# EAGLE design 04B-345 (EAGLE 9.6.2)
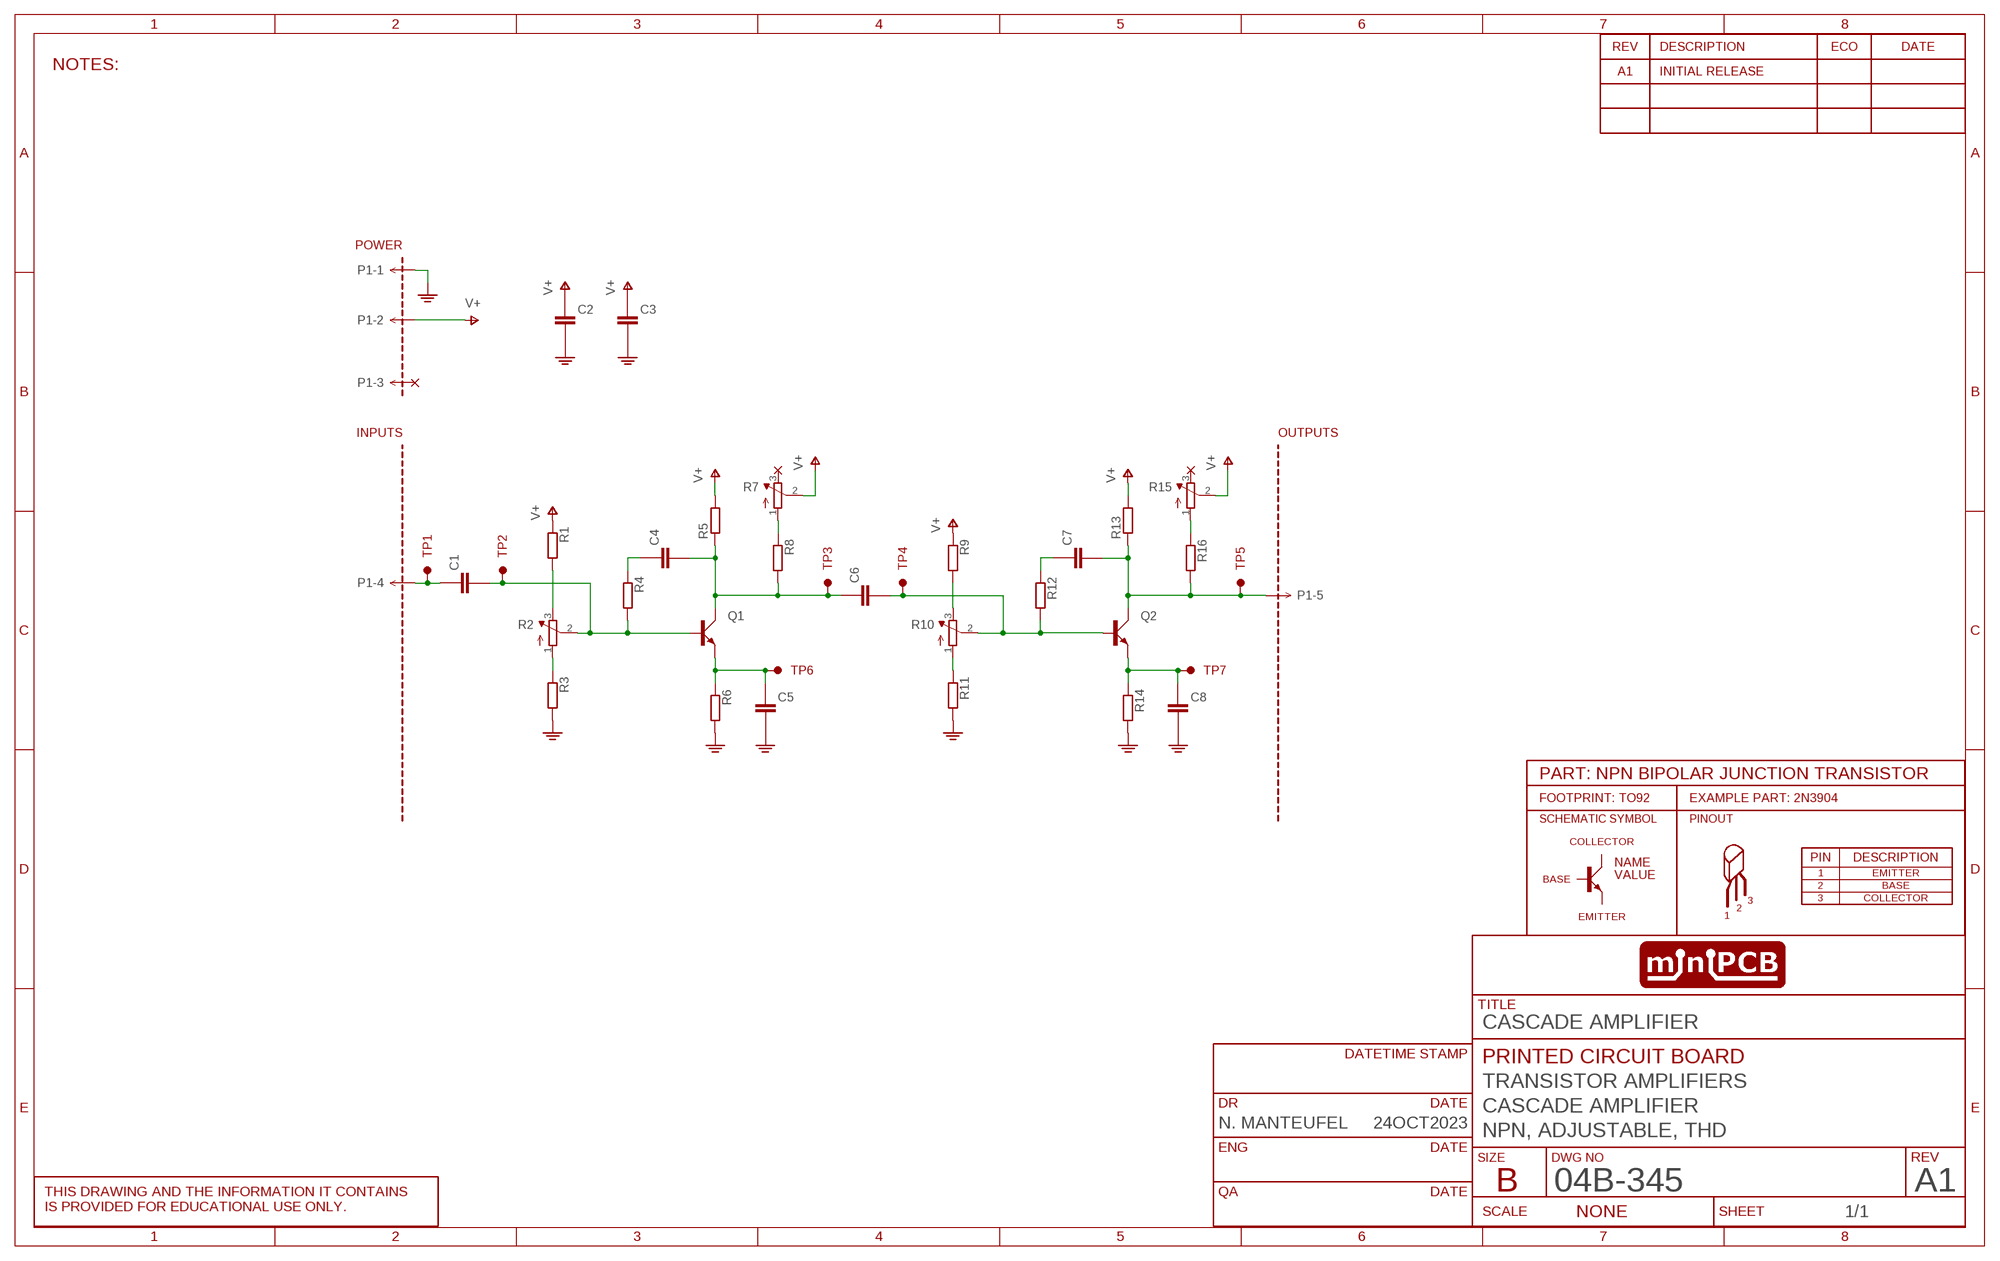
[diagram p0: schematic, sheet 1]
SHEET1 (SCHEMATIC): CIRCUIT_CATEGORY: TRANSISTOR AMPLIFIERS; CIRCUIT_NAME: CASCADE AMPLIFIER; CIRCUIT_VARIANT: NPN, ADJUSTABLE, THD; DR: N. MANTEUFEL; DR_DATE: 24OCT2023; PCB_PCBA: PRINTED CIRCUIT BOARD; REVA: A1; REVISION: A1; TITLE: CASCADE AMPLIFIER

## Parts
C1  CAPACITORTHD  [C050-024X044]
C2  CAPACITORTHD  [C050-024X044]
C3  CAPACITOR_10  [C5MM]
C4  CAPACITORTHD  [C050-024X044]
C5  CAPACITOR_10  [C5MM]
C6  CAPACITORTHD  [C050-024X044]
C7  CAPACITORTHD  [C050-024X044]
C8  CAPACITOR_10  [C5MM]
P1  MINIPCB_5P5P  [PINS_1X5]
PCB1  MINIPCB_0P50X75  [MINIPCB_0P_50X75]
Q1  BJT_NPNEBC  [TO92-EBC-OVAL]
Q2  BJT_NPNEBC  [TO92-EBC-OVAL]
R1  RESISTORTHD  [0204/10]
R2  TRIMPOT0.100THD  [TRIM_0100]
R3  RESISTORTHD  [0204/10]
R4  RESISTORTHD  [0204/10]
R5  RESISTORTHD  [0204/10]
R6  RESISTORTHD  [0204/10]
R7  TRIMPOT0.100THD  [TRIM_0100]
R8  RESISTORTHD  [0204/10]
R9  RESISTORTHD  [0204/10]
R10  TRIMPOT0.100THD  [TRIM_0100]
R11  RESISTORTHD  [0204/10]
R12  RESISTORTHD  [0204/10]
R13  RESISTORTHD  [0204/10]
R14  RESISTORTHD  [0204/10]
R15  TRIMPOT0.100THD  [TRIM_0100]
R16  RESISTORTHD  [0204/10]
TP1  TESTPOINTKE5000-SMTEXT  [PINS_1_TESTPOINT_KE5000_NOTEXT]
TP2  TESTPOINTKE5000-SMTEXT  [PINS_1_TESTPOINT_KE5000_NOTEXT]
TP3  TESTPOINTKE5000-SMTEXT  [PINS_1_TESTPOINT_KE5000_NOTEXT]
TP4  TESTPOINTKE5000-SMTEXT  [PINS_1_TESTPOINT_KE5000_NOTEXT]
TP5  TESTPOINTKE5000-SMTEXT  [PINS_1_TESTPOINT_KE5000_NOTEXT]
TP6  TESTPOINTKE5000-SMTEXT  [PINS_1_TESTPOINT_KE5000_NOTEXT]
TP7  TESTPOINTKE5000-SMTEXT  [PINS_1_TESTPOINT_KE5000_NOTEXT]

## Nets
GND: C2.2(-) C3.- C5.- C8.- P1.1 R3.2 R6.2 R11.2 R14.2
N$1: C4.2(-) C6.1(+) Q1.C R5.1 R8.2 TP3.1
N$2: C5.+ Q1.E R6.1 TP6.1
N$3: C7.2(-) P1.5 Q2.C R13.1 R16.2 TP5.1
N$4: C8.+ Q2.E R14.1 TP7.1
N$5: C7.1(+) R12.1
N$6: C6.2(-) Q2.B R10.2(S) R12.2 TP4.1
N$7: R1.2 R2.3(E)
N$8: R2.1(A) R3.1
N$9: C1.2(-) Q1.B R2.2(S) R4.2 TP2.1
N$10: C4.1(+) R4.1
N$11: R9.2 R10.3(E)
N$12: R10.1(A) R11.1
N$13: C1.1(+) P1.4 TP1.1
N$14: R7.1(A) R8.1
N$15: R15.1(A) R16.1
V+: C2.1(+) C3.+ P1.2 R1.1 R5.2 R7.2(S) R9.1 R13.2 R15.2(S)
Unconnected: P1.3 R7.3(E) R15.3(E)

## Notes on the sheet
- NOTES:

## Library data of the parts
C1-C8 = minipcb:CAPACITOR
P1 = minipcb:MINIPCB_5P
PCB1 = minipcb:MINIPCB_0P
Q1 Q2 = minipcb:BJT_NPN: TRANSISTOR
R1 R3-R6 R8 R9 R11-R14 R16 = minipcb:RESISTOR
R2 R7 R10 R15 = minipcb:TRIMPOT: SMT trimmer potentiometer part number TC33X http://www.ladyada.net/library/eagle
TP1-TP7 = minipcb:TESTPOINT

## Board
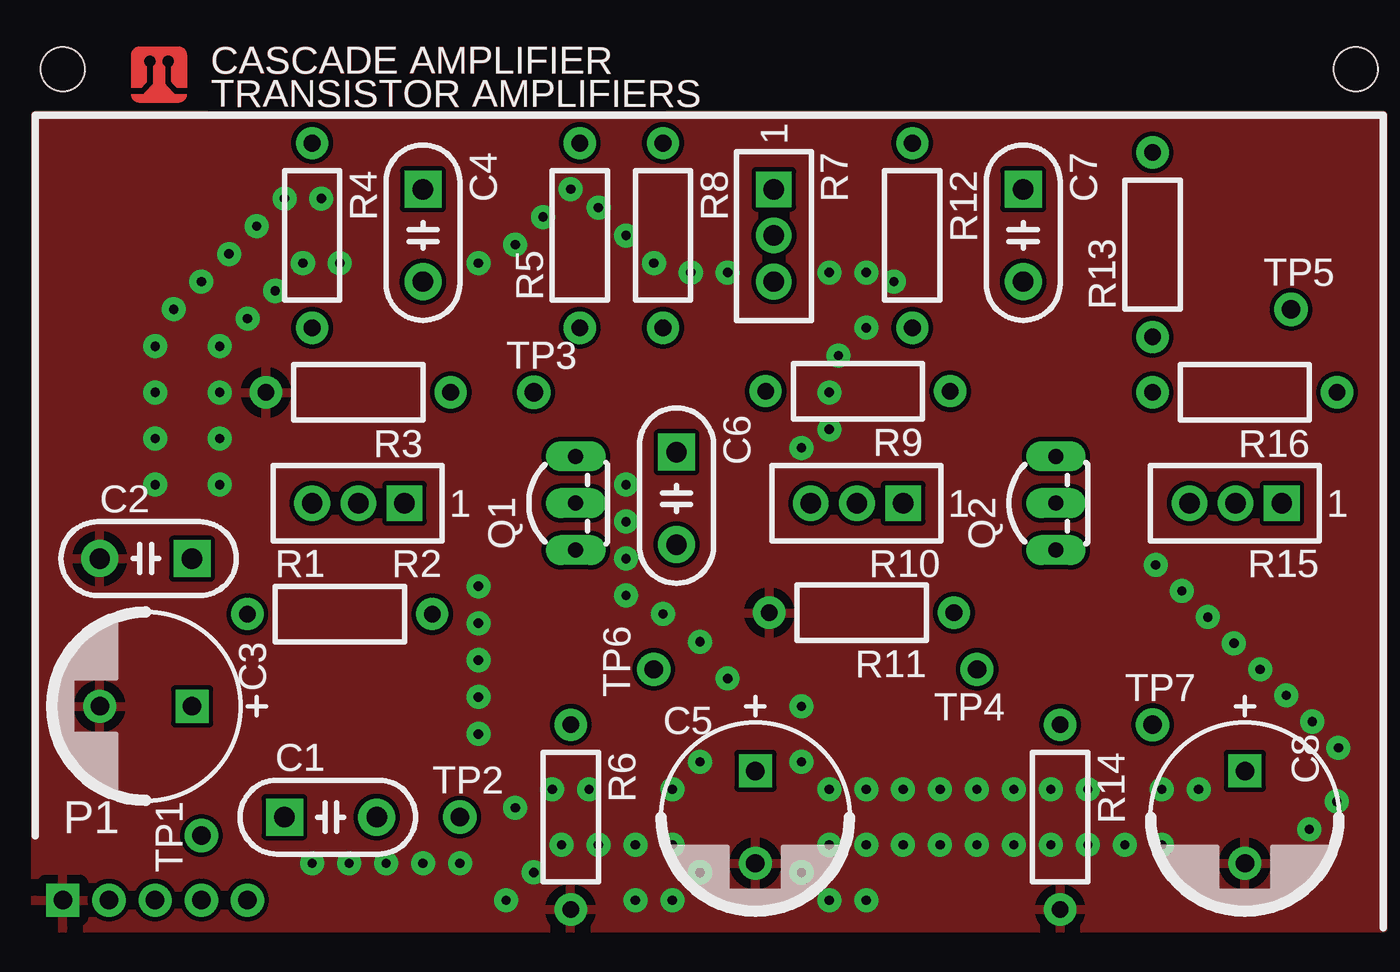
[diagram p1: board, top side]
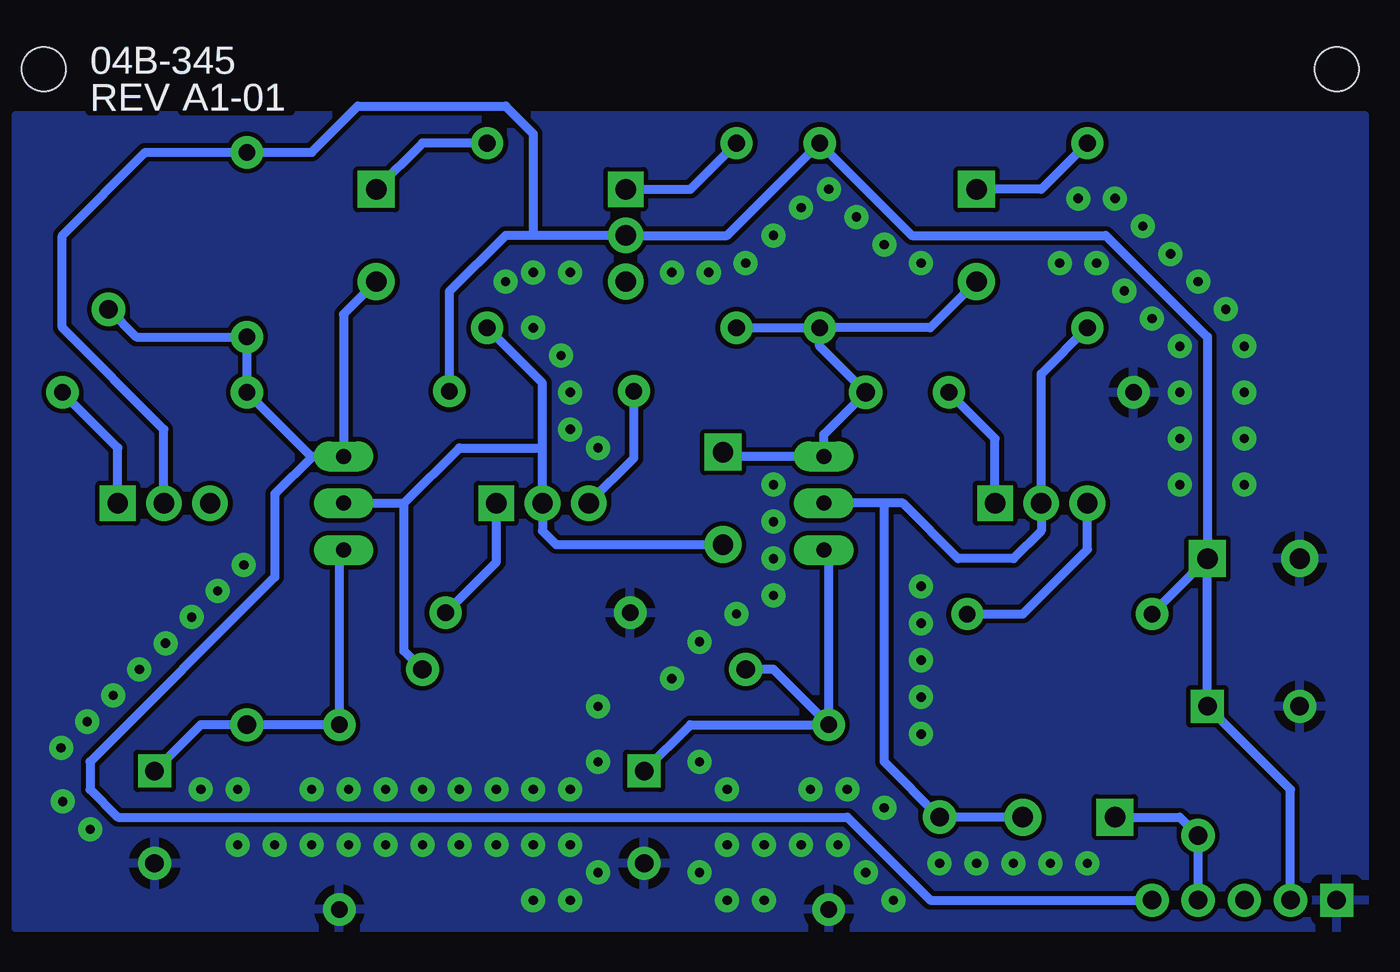
[diagram p2: board, bottom side, seen from below]

No outline drawn. Coordinates in mm, seen from the top.
Copper layers (1*16): Top 0.035mm / dielectric 1.5mm / Bottom 0.035mm
Design rules "minipcb": minimum track width 0.2mm, minimum drill 0.5mm, track to track 0.25mm, track to pad 0.5mm, pad to pad 0.5mm, via to via 0.5mm, smd to smd 0.15mm, copper to edge 1mm, drill to drill 1mm, minimum pad ring 0.4mm, minimum via ring 0.4mm, stop-mask expansion 0.1mm, vias tented up to drill 0.6mm, thermal gap 0.5mm

### Footprints (pad centres in the part's own frame; a part is rotated, then mirrored left to right if it is on the bottom)
C050-024X044 = drill 1.1 pad 2 square: 1 -2.5,0 | drill 1.1 pad 2: 2 2.5,0
C5MM = drill 1 square: + -2.5,0 | drill 1: - 2.5,0
PINS_1X5 = drill 1 square: 1 0,0 | drill 1: 2 2.5,0; 3 5,0; 4 7.5,0; 5 10,0
MINIPCB_0P_50X75 = hole 2.4: 72.5,47.5; 2.5,47.5
TO92-EBC-OVAL = drill 0.813 long: B 0,-1.27; C 2.54,-1.27; E -2.54,-1.27
0204/10 = drill 0.9 pad 1.75: 1 -5,0; 2 5,0
TRIM_0100 = drill 1.1 pad 1.93 square: 1 0,0 | drill 1.1 pad 1.93: 2 2.5,0; 3 5,0
PINS_1_TESTPOINT_KE5000_NOTEXT = drill 1: 1 0,0

### Placement (x,y rotation side)
C1  17,7 0 top
C2  7,21 180 top
C3  7,13 180 top
C4  22,38.5 270 top
C5  40,7 270 top
C6  35.73,24.26 270 top
C7  54.5,38.5 270 top
C8  66.5,7 270 top
P1  2.5,2.5 0 top
PCB1  0,0 0 top
Q1  29,24 90 top
Q2  55,24 90 top
R1  17.5,18 0 top
R2  21,24 180 top
R3  18.5,30 180 top
R4  16,38.5 270 top
R5  30.5,38.5 90 top
R6  30,7 270 top
R7  41,41 270 top
R8  35,38.5 270 top
R9  45.55,30.07 180 top
R10  48,24 180 top
R11  45.75,18.07 180 top
R12  48.5,38.5 270 top
R13  61.5,38 90 top
R14  56.5,7 270 top
R15  68.5,24 180 top
R16  66.5,30 180 top
TP1  10,6 90 top
TP2  24,7 0 top
TP3  28,30 0 top
TP4  52,15 180 top
TP5  69,34.5 0 top
TP6  34.5,15 90 top
TP7  61.5,12 0 top

### Tracks (layer width: path | path; a pad name or v marks a point on that pad's centre or on a via)
GND  (via drill 0.5)
  other vias: 11.5,37.5 13,39 14.5,40.5 10,36 8.5,34.5 7.5,32.5 7.5,30 7.5,27.5 7.5,25 11,25 11,27.5 11,30 11,32.5 12.5,34 14,35.5 15.5,37 17.5,37 16.5,40.5 25,37 27,38 28.5,39.5 30,41 31.5,40 33,38.5 34.5,37 36.5,36.5 38.5,36.5 44,36.5 46,36.5 47.5,36 46,33.5 44.5,32 44,30 44,28 42.5,27 46,8.5 48,8.5 50,8.5 52,8.5 54,8.5 46,5.5 48,5.5 50,5.5 52,5.5 54,5.5 56,5.5 58,5.5 56,8.5 58,8.5 62,8.5 64,8.5 60,5.5 62,5.5 71.49,7.84 71.57,10.76 70.16,12.17 68.74,13.59 67.33,15 65.91,16.41 64.5,17.83 63.09,19.24 61.67,20.66 69.99,6.34 44,8.5 42.5,10 44,5.5 42.5,4 37,4 35.5,5.5 37,10 35.5,8.5 33.5,5.5 31,8.5 31.5,5.5 29.5,5.5 29,8.5 27,7.5 28,4 26.5,2.5 24,4.5 22,4.5 20,4.5 18,4.5 16,4.5 33.5,2.5 35.5,2.5 44,2.5 46,2.5 25,19.5 25,17.5 25,15.5 25,13.5 25,11.5 33,25 33,23 33,21 33,19 35,18 37,16.5 38.5,14.5 42.5,13
  pour Top: 1,1 74,1 74,45 1,45
  pour Bottom: 1,1 74,1 74,45 1,45
N$1
  Bottom 0.5: C4.2 24.5,33.5 R5.1 | R8.2 R5.1 | R5.1 30.5,32.5 TP3.1 30.27,27.73 Q1.C 35.51,26.54 C6.1
N$2
  Bottom 0.5: R6.1 30,21.19 Q1.E | C5.+ 37.5,12 R6.1 | R6.1 33,15 TP6.1
N$3
  Bottom 0.5: C7.2 56.27,34.23 Q2.C | TP5.1 67.5,33 R13.1 R16.2 58.04,26.54 Q2.C | Q2.C 57.96,26.54 60,24.5 60,20 70,10 70,8.5 68.5,7 29,7 24.5,2.5 P1.5
N$4
  Bottom 0.5: Q2.E 56.5,21.23 R14.1 TP7.1 64,12 C8.+
N$5
  Bottom 0.5: R12.1 52,43.5 C7.1
N$6
  Bottom 0.5: C6.2 44.76,21.76 45.5,22.5 R10.2 45.5,27 | 45.5,27 45.5,30.5 R12.2 | Q2.B 53,24 | 45.5,27 50,27 53,24 | TP4.1 53,16 53,24
N$7
  Bottom 0.5: R1.2 19.5,18 16,21.5 R2.3
N$8
  Bottom 0.5: R2.1 21,27.5 R3.1
N$9
  Bottom 0.5: R4.2 18.5,31 R2.2 18.5,22.5 20,21 23,21 26,24 27,24 | 27,24 Q1.B | C1.2 TP2.1 27,10 27,24
N$10
  Bottom 0.5: R4.1 18.5,41 C4.1
N$11
  Bottom 0.5: R10.3 40.55,26.45 R9.2
N$12
  Bottom 0.5: R11.1 48,20.82 R10.1
N$13
  Bottom 0.5: P1.4 TP1.1 11,7 C1.1
N$14
  Bottom 0.5: R7.1 37.5,41 R8.1
N$15
  Bottom 0.5: R15.1 68.5,27 R16.1
V+
  Bottom 0.5: P1.2 5,8.5 C3.+ C2.1 | C2.1 9.5,33 15,38.5 25.5,38.5 R5.2 35.5,38.5 R7.2 46,38.5 | 46,38.5 47.5,38.5 50.55,35.45 R9.1 | 46,38.5 46,44 47.5,45.5 55.5,45.5 58,43 R13.2 67,43 71.5,38.5 71.5,33.5 66,28 R15.2 | C2.1 R1.1

### Text on the board
_tNames: C4 | R7 | C7 | R4 | R8 | R12 | TP5 | R5 | R13 | TP3 | C6 | R3 | R9 | R16 | C2 | R2 | Q1 | R10 | Q2 | R15 | R1 | C3 | R11 | TP4 | TP6 | TP7 | C5 | C8 | R6 | R14 | C1 | TP2 | TP1